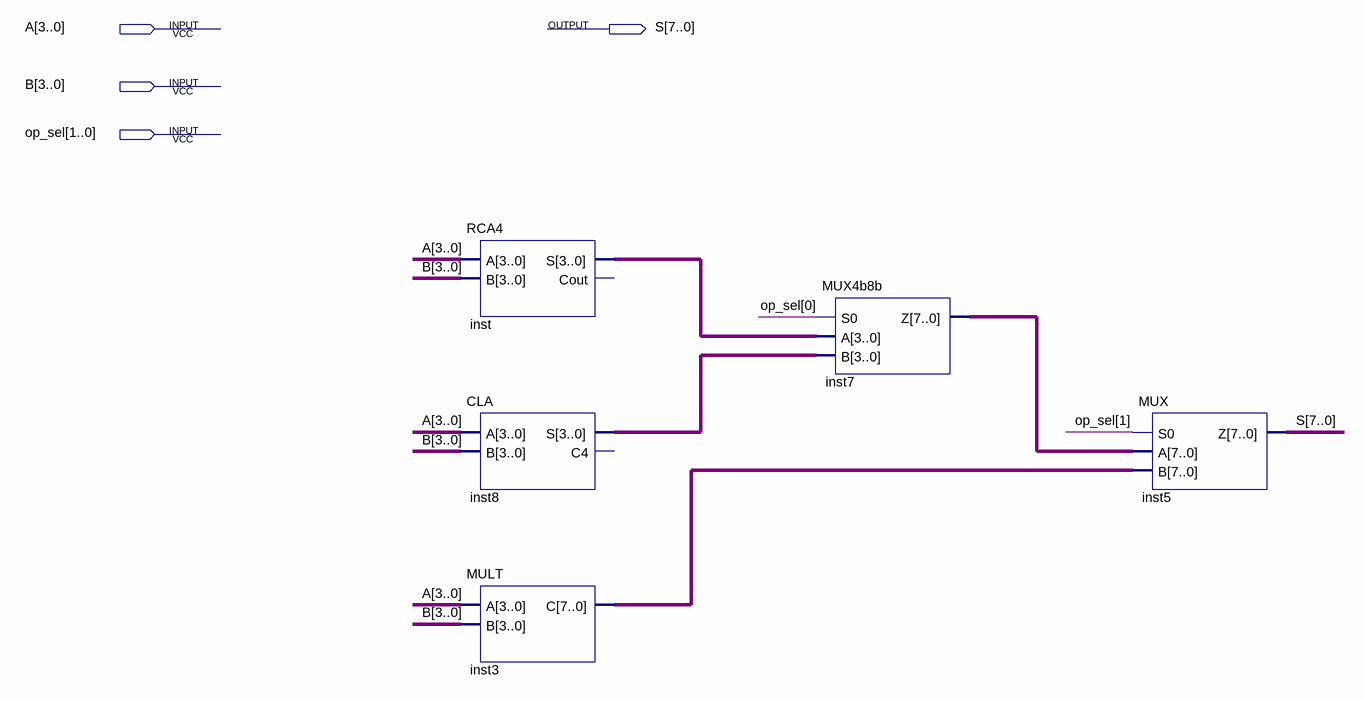
[diagram p0: schematic sheet]
// Quartus schematic UnidadeAritmetica.bdf as structural Verilog: 5 symbols, 4 pins
module UnidadeAritmetica (
  input  [3:0] A,
  input  [3:0] B,
  input  [1:0] op_sel,
  output [7:0] S
);

  wire [3:0] inst8_s, inst_s;
  wire [7:0] inst3_c, inst7_z;

  RCA4 inst (.A(A), .B(B), .S(inst_s));  // open: Cout
  CLA inst8 (.A(A), .B(B), .S(inst8_s));  // open: C4
  MULT inst3 (.A(A), .B(B), .C(inst3_c));
  MUX4b8b inst7 (.S0(op_sel[0]), .A(inst_s), .B(inst8_s), .Z(inst7_z));
  MUX inst5 (.S0(op_sel[1]), .A(inst7_z), .B(inst3_c), .Z(S));
endmodule
